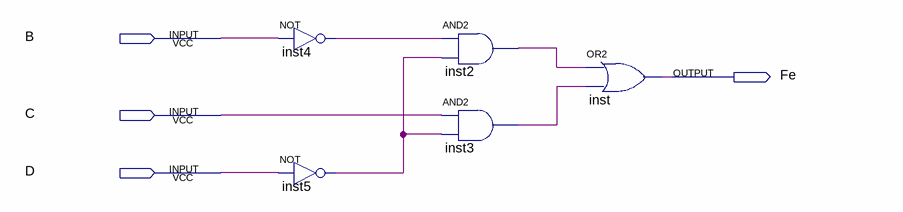
[diagram p0: schematic sheet]
// Quartus schematic Fe.bdf as structural Verilog: 5 symbols, 4 pins
module Fe (
  input  B,
  input  C,
  input  D,
  output Fe
);

  wire inst2_out, inst3_out, inst4_out, inst5_out;

  not inst4 (inst4_out, B);
  not inst5 (inst5_out, D);
  and inst2 (inst2_out, inst4_out, inst5_out);
  and inst3 (inst3_out, C, inst5_out);
  or inst (Fe, inst2_out, inst3_out);
endmodule
